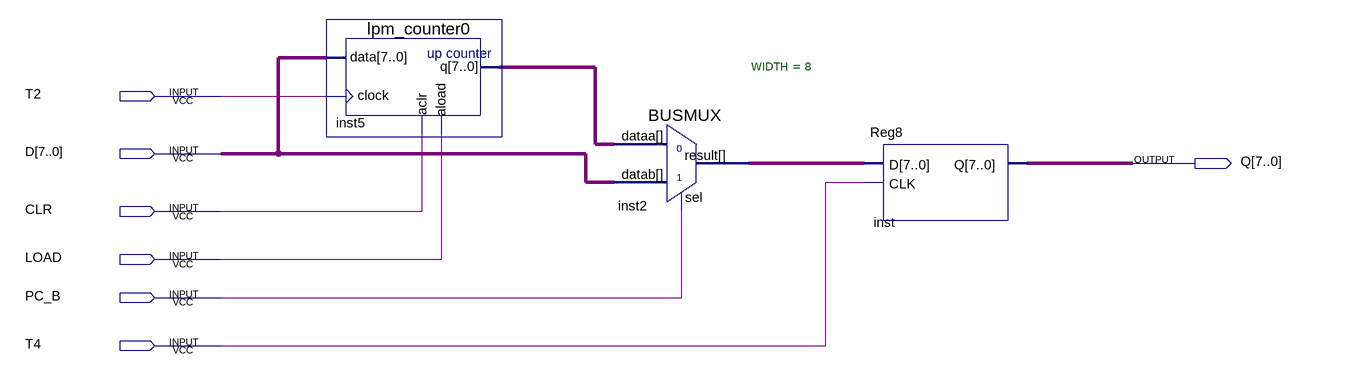
[diagram p0: schematic sheet]
// Quartus schematic PC_AR.bdf as structural Verilog: 3 symbols, 7 pins
module PC_AR (
  input  T2,
  input  [7:0] D,
  input  CLR,
  input  LOAD,
  input  PC_B,
  input  T4,
  output [7:0] Q
);

  wire [7:0] inst2_result, inst5_q;

  lpm_counter0 inst5 (.data(D), .clock(T2), .aclr(CLR), .aload(LOAD), .q(inst5_q));
  BUSMUX #(.WIDTH(8)) inst2 (.datab(D), .sel(PC_B), .dataa(inst5_q), .result(inst2_result));
  Reg8 inst (.D(inst2_result), .CLK(T4), .Q(Q));
endmodule
